# EAGLE design sensor (EAGLE 7.1.0)
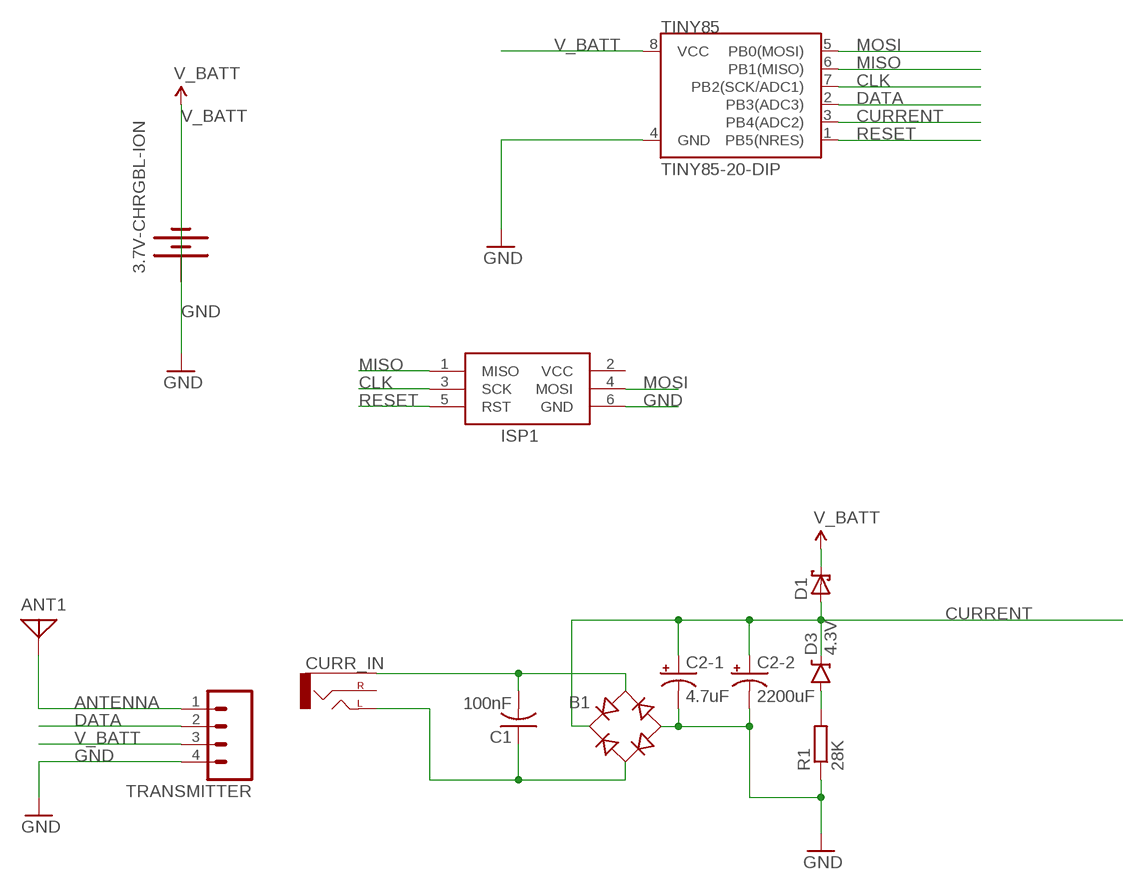
[diagram p0: schematic, sheet 1]

## Parts
3.7V-CHRGBL-ION  BATTERY20PTH  [BATTCOM_20MM_PTH]
ANT1  ANTENNA  [PAD-01]
B1  B-DIL  [B-DIL]
C1  100nF  C-US075-032X103  [C075-032X103]
C2-1  4.7uF  CPOL-USE5-4  [E5-4]
C2-2  2200uF  CAP_POLPTH4  [CPOL-RADIAL-1000UF-25V]
CURR_IN  AUDIO-JACKPTH  [AUDIO-JACK]
D1  SCHOTTKY-DIODEDO35-7  [DO35-7]
D3  4.3V  DIODE-ZENERPTH  [DIODE-ZENER]
ISP1  AVRISP-BOX  [AVRISP-BOX]
R1  28K  R-EU_0207/10  [0207/10]
TINY85  TINY85-20-DIP  ATTINY45TINY85-20-DIP  [DIP08]
TRANSMITTER  M04PTH  [1X04]

## Nets
ANTENNA: ANT1.1 TRANSMITTER.1
CLK: ISP1.3(SCK) TINY85.7(PB2(SCK/ADC1))
CURRENT: B1.+ C2-1.+ C2-2.+ D1.A D3.P$1(C) TINY85.3(PB4(ADC2))
DATA: TINY85.2(PB3(ADC3)) TRANSMITTER.2
GND: 3.7V-CHRGBL-ION.2(-) B1.- C2-1.- C2-2.- ISP1.6(GND) R1.1 TINY85.4(GND) TRANSMITTER.4
MISO: ISP1.1(MISO) TINY85.6(PB1(MISO))
MOSI: ISP1.4(MOSI) TINY85.5(PB0(MOSI))
N$1: B1.AC1 C1.2 CURR_IN.SLEEVE
N$2: B1.AC2 C1.1 CURR_IN.TIP(LEFT)
N$7: D3.P$2(A) R1.2
RESET: ISP1.5(RST) TINY85.1(PB5(NRES))
V_BATT: 3.7V-CHRGBL-ION.1(+) D1.C TINY85.8(VCC) TRANSMITTER.3
Unconnected: CURR_IN.RING(RIGHT)

## Power pins joined to a net without a drawn wire
VCC: ISP1.2(VCC)

## Library data of the parts
3.7V-CHRGBL-ION = SparkFun-Electromechanical:BATTERY: Battery Holders Various common sizes : AA, AAA, 20mm coin cell and 12mm coin cell. 20MM_4LEGS, BATT-10373
ANT1 = discrete:ANTENNA: Antenna
B1 = rectifier:B-DIL: RECTIFIER
C1 = adafruit:C-US: CAPACITOR, American symbol
C2-1 = adafruit:CPOL-US: POLARIZED CAPACITOR, American symbol
C2-2 = SparkFun-Capacitors:CAP_POL: Capacitor Polarized These are standard SMD and PTH capacitors. Normally 10uF, 47uF, and 100uF in electrolytic and tantalum varieties. Always verify the external diameter of the through hole cap, it varies with capacity, voltage, and manufacturer. The EIA devices should be standard.
CURR_IN = SparkFun-Connectors:AUDIO-JACK: 3.5mm Audio Jack Simple 3.5mm common PCB mount audio jack. SKU: PRT-08032
D1 = adafruit:SCHOTTKY-DIODE: Schottky Diode
D3 = SparkFun-DiscreteSemi:DIODE-ZENER: Zener Diode Production Part - 8199 3.4V Zener Voltage
ISP1 = adafruit:AVRISP: AVR ISP HEADER Standard 6 pin header for AVR programming
R1 = rcl:R-EU_: RESISTOR, European symbol
TINY85 = SparkFun-DigitalIC:ATTINY45: Atmel 8-pin 2/4/8kB flash uC; PROD_ID: IC-09445
TRANSMITTER = SparkFun-Connectors:M04: Header 4 Standard 4-pin 0.1" header. Use with straight break away headers (SKU : PRT-00116), right angle break away headers (PRT-00553), swiss pins (PRT-00743), machine pins (PRT-00117), and female headers (PRT-00115). Molex polarized connector foot print use with SKU : PRT-08231 with associated crimp pins and housings. 1MM SMD Version SKU: PRT-10208

## Board
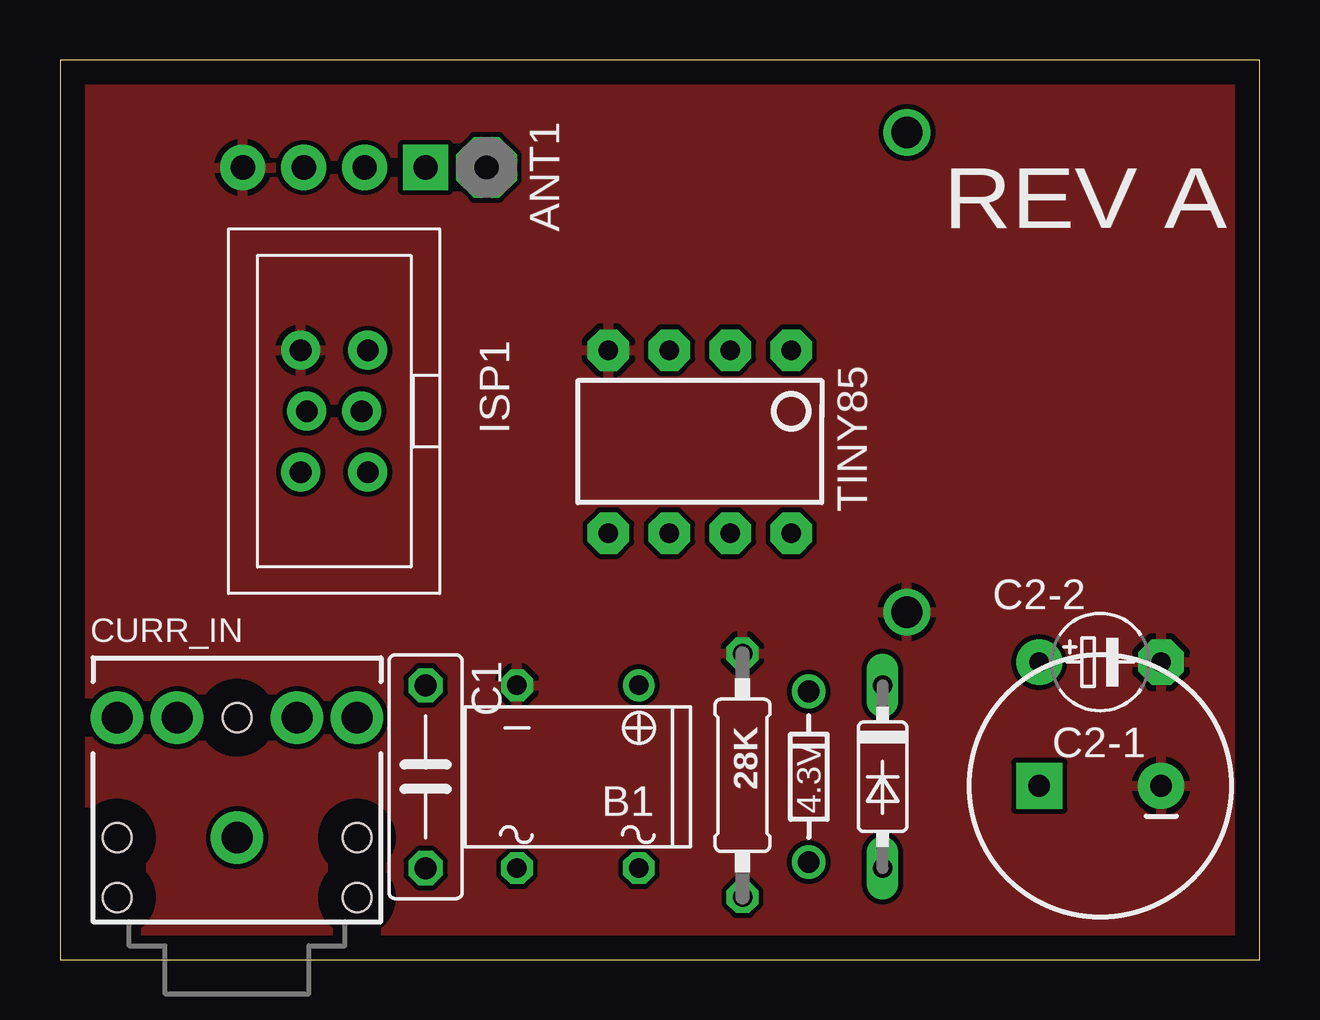
[diagram p1: board, top side]
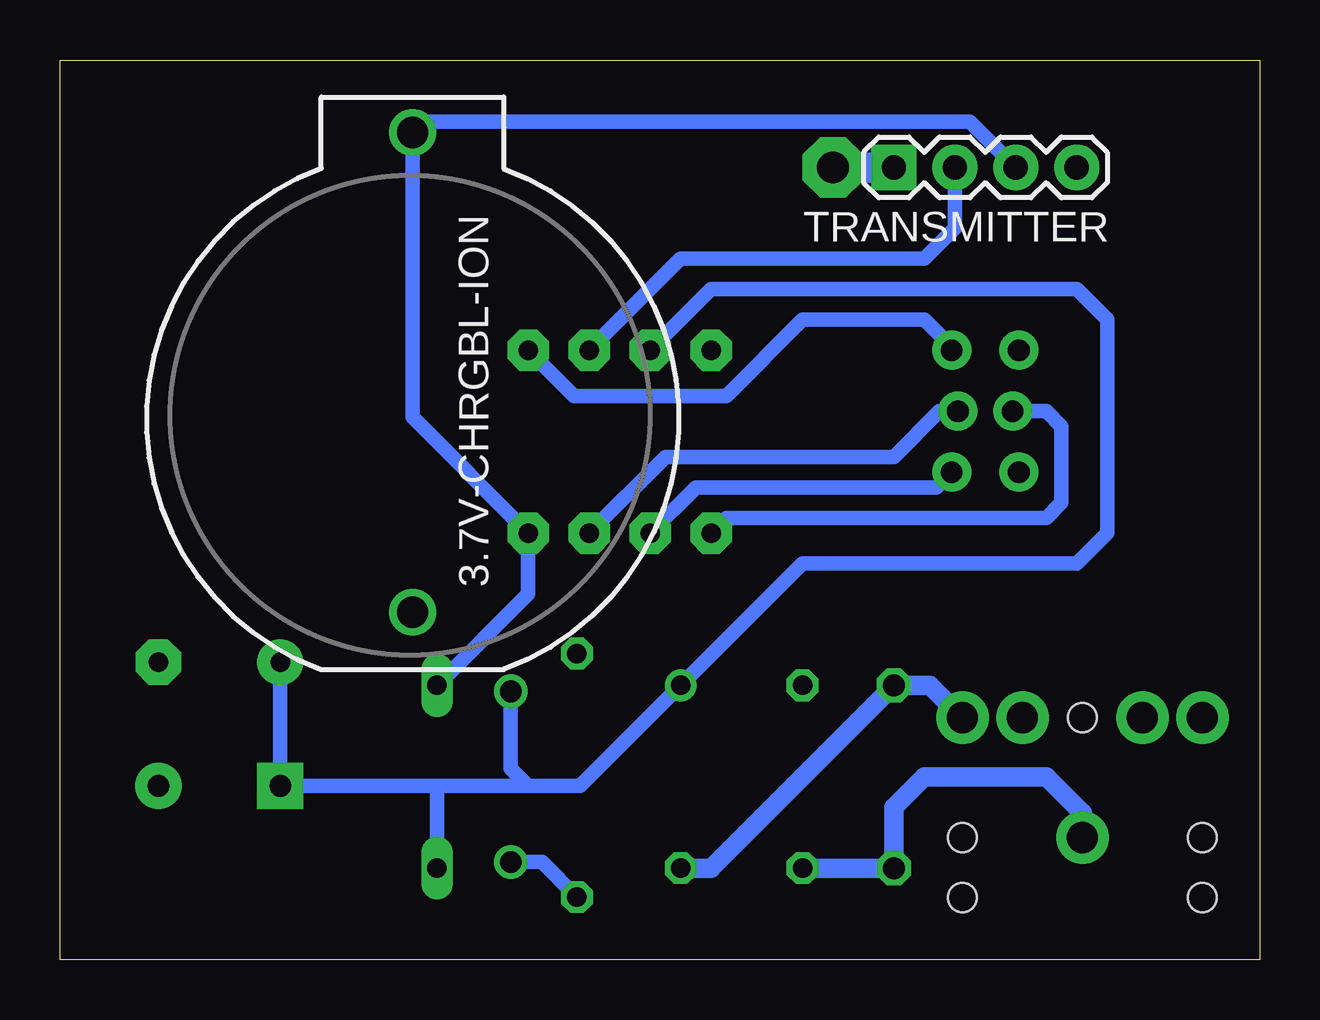
[diagram p2: board, bottom side, seen from below]

Size 50 x 37.5 mm. Coordinates in mm from the lower left corner, seen from the top.
Outline: 0,0 50,0 50,37.5 0,37.5 0,0
Copper layers (1*16): Top 0.035mm / dielectric 1.5mm / Bottom 0.035mm
Design rules "default": minimum track width 10mil, minimum drill 24mil, track to track 8mil, track to pad 8mil, pad to pad 8mil, via to via 8mil, smd to smd 8mil, copper to edge 40mil, drill to drill 8mil, minimum pad ring 10mil, minimum via ring 8mil, stop-mask expansion 4mil, vias tented up to drill 0mil, thermal gap 10mil

### Footprints (pad centres in the part's own frame; a part is rotated, then mirrored left to right if it is on the bottom)
BATTCOM_20MM_PTH = drill 1.3: 1 11.85,0; 2 -8.15,0
PAD-01 = drill 1.321 pad 2.54 octagon: 1 0,0
B-DIL = drill 0.813: + -2.54,-3.81 | drill 0.813 octagon: - 2.54,-3.81; AC1 2.54,3.81; AC2 -2.54,3.81
C075-032X103 = drill 0.914 octagon: 1 -3.81,0; 2 3.81,0
E5-4 = drill 0.813 pad 1.905: + -2.54,0 | drill 0.813 pad 1.905 octagon: - 2.54,0
CPOL-RADIAL-1000UF-25V = drill 0.9 pad 1.93 square: + 2.54,0 | drill 0.9 pad 1.93: - -2.54,0
AUDIO-JACK = drill 1.3 pad 2.184: RING 5,5; RSH 5,2.5; SLEEVE 0,0; TIP 5,-5; TSH 5,-2.5 | hole 1.2: 0,5; -2.5,5; -2.5,-5; 0,-5; 5,0
DO35-7 = drill 0.813 long: A 3.81,0; C -3.81,0
DIODE-ZENER = drill 0.9: P$1 -3.556,0; P$2 3.556,0
AVRISP-BOX = drill 0.9 pad 1.626: 1 -1.397,2.54; 2 1.397,2.54; 3 -1.143,0; 4 1.143,0; 5 -1.397,-2.54; 6 1.397,-2.54
0207/10 = drill 0.813 octagon: 1 -5.08,0; 2 5.08,0
DIP08 = drill 0.813 pad 1.727 octagon: 1 -3.81,-3.81; 2 -1.27,-3.81; 3 1.27,-3.81; 4 3.81,-3.81; 5 3.81,3.81; 6 1.27,3.81; 7 -1.27,3.81; 8 -3.81,3.81
1X04 = drill 1.016 pad 1.88 square: 1 0,0 | drill 1.016 pad 1.88: 2 2.54,0; 3 5.08,0; 4 7.62,0

### Placement (x,y rotation side)
3.7V-CHRGBL-ION  35.3,22.63 90 bottom
ANT1  17.78,33.02 180 top
B1  21.59,7.62 180 top
C1  15.24,7.62 270 top
C2-1  43.36,12.4 0 top
C2-2  43.36,7.24 180 top
CURR_IN  7.38,5.08 90 top
D1  34.29,7.62 270 top
D3  31.21,7.62 270 top
ISP1  11.43,22.86 180 top
R1  28.45,7.68 270 top
TINY85  26.67,21.59 180 top
TRANSMITTER  15.24,33.02 0 bottom

### Tracks (layer width: path | path; a pad name or v marks a point on that pad's centre or on a via)
ANTENNA
  Bottom 1.27: TRANSMITTER.1 ANT1.1
CLK
  Bottom 0.61: ISP1.3 13.34,22.86 15.24,20.95 24.77,20.95 TINY85.7
CURRENT
  Bottom 0.61: 34.29,7.24 C2-2.+ C2-1.+ | 34.29,7.24 30.48,7.24 | 30.48,7.24 28.32,7.24 B1.+ 19.05,16.51 7.62,16.51 6.35,17.78 6.35,26.67 7.62,27.94 22.86,27.94 TINY85.3 | D3.P$1 31.21,7.97 30.48,7.24 | D1.A 34.29,7.24
DATA
  Bottom 0.61: TRANSMITTER.2 12.7,30.48 13.97,29.21 24.13,29.21 TINY85.2
GND
  pour Top: 0,37.5 50,37.5 50,0 0,0
MISO
  Bottom 0.61: TINY85.6 23.5,19.68 13.46,19.68 ISP1.1
MOSI
  Bottom 0.61: ISP1.4 8.89,22.86 8.26,22.23 8.26,19.05 8.89,18.41 22.23,18.41 TINY85.5
N$1
  Bottom 0.813: B1.AC1 C1.2 15.24,6.35 13.97,7.62 8.89,7.62 7.38,6.11 CURR_IN.SLEEVE
N$2
  Bottom 0.813: B1.AC2 22.86,3.81 C1.1 13.73,11.43 CURR_IN.TIP
N$7
  Bottom 0.61: D3.P$2 29.91,4.06 R1.2
RESET
  Bottom 0.61: ISP1.5 12.83,25.53 13.97,26.67 19.05,26.67 22.23,23.5 28.57,23.5 TINY85.1
V_BATT
  Bottom 0.61: D1.C 30.48,15.24 TINY85.8 35.3,22.61 3.7V-CHRGBL-ION.1 34.86,34.92 12.06,34.92 TRANSMITTER.3

### Text on the board
tNames: REV A